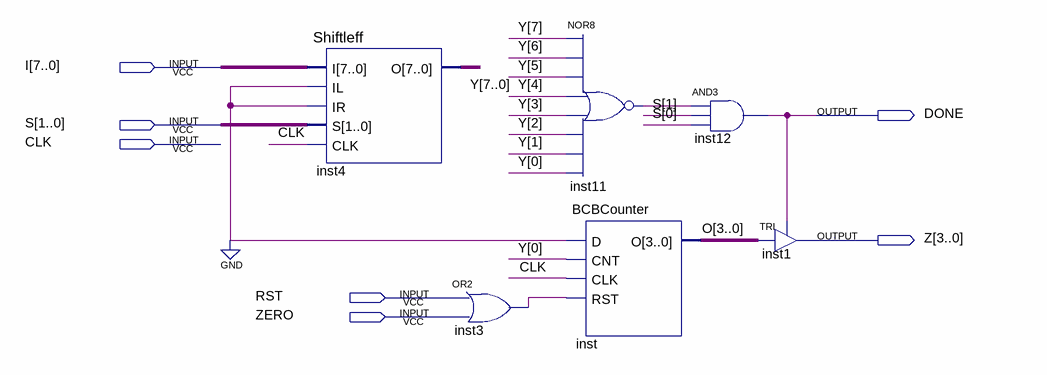
[diagram p0: schematic sheet]
// Quartus schematic Datapath.bdf as structural Verilog: 6 symbols, 7 pins
module Datapath (
  input  [7:0] I,
  input  [1:0] S,
  input  CLK,
  input  RST,
  input  ZERO,
  output DONE,
  output [3:0] Z
);

  wire inst3_out, inst11_out;
  wire [3:0] O;
  wire [7:0] Y;

  Shiftleff inst4 (.I(I), .IL(1'b0), .IR(1'b0), .S(S), .CLK(CLK), .O(Y));
  or inst3 (inst3_out, RST, ZERO);
  nor inst11 (inst11_out, Y[7], Y[6], Y[5], Y[4], Y[3], Y[2], Y[1], Y[0]);
  BCBCounter inst (.D(1'b0), .CNT(Y[0]), .CLK(CLK), .RST(inst3_out), .O(O));
  and inst12 (DONE, inst11_out, S[1], S[0]);
  TRI inst1[3:0] (.IN(O), .OE(DONE), .OUT(Z));
endmodule
